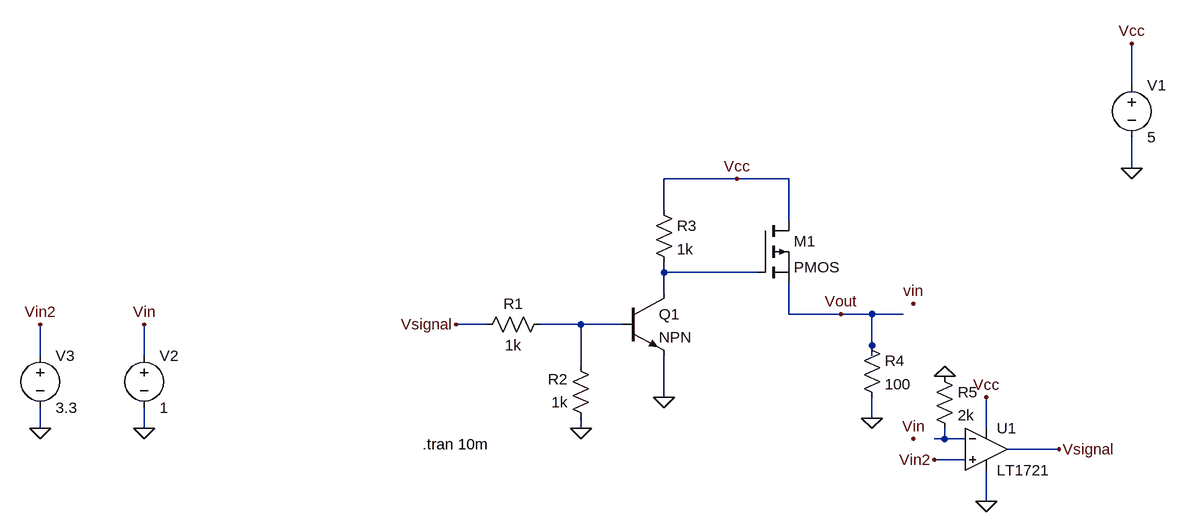
[diagram p0: schematic mosfet_as_relay.asc]
mosfet_as_relay.asc, the LTspice schematic file:
Version 4
SHEET 1 952 680
WIRE 896 -192 896 -256
WIRE 896 -64 896 -112
WIRE 288 -48 176 -48
WIRE 368 -48 288 -48
WIRE 176 0 176 -48
WIRE 368 16 368 -48
WIRE 176 96 176 80
WIRE 320 96 176 96
WIRE 176 128 176 96
WIRE 368 160 368 112
WIRE 448 160 368 160
WIRE 496 160 448 160
WIRE 544 160 496 160
WIRE -96 176 -144 176
WIRE 48 176 -16 176
WIRE 112 176 48 176
WIRE 496 208 496 160
WIRE -784 224 -784 176
WIRE -624 224 -624 176
WIRE 496 224 496 208
WIRE 48 240 48 176
WIRE 176 288 176 224
WIRE 496 320 496 288
WIRE -784 336 -784 304
WIRE -624 336 -624 304
WIRE 48 336 48 320
WIRE 672 336 672 288
WIRE 608 352 608 336
WIRE 608 352 592 352
WIRE 640 352 608 352
WIRE 784 368 704 368
WIRE 640 384 592 384
WIRE 672 448 672 400
FLAG 176 288 0
FLAG 448 160 Vout
FLAG 48 336 0
FLAG -144 176 Vsignal
FLAG 896 -64 0
FLAG 896 -256 Vcc
FLAG 288 -48 Vcc
FLAG -624 336 0
FLAG -624 176 Vin
FLAG -784 336 0
FLAG -784 176 Vin2
FLAG 672 448 0
FLAG 672 288 Vcc
FLAG 784 368 Vsignal
FLAG 592 384 Vin2
FLAG 560 352 Vin
FLAG 560 144 vin
FLAG 496 320 0
FLAG 608 256 0
SYMBOL npn 112 128 R0
SYMATTR InstName Q1
SYMBOL res 0 160 R90
WINDOW 0 0 56 VBottom 2
WINDOW 3 32 56 VTop 2
SYMATTR InstName R1
SYMATTR Value 1k
SYMBOL res 64 336 R180
WINDOW 0 36 76 Left 2
WINDOW 3 36 40 Left 2
SYMATTR InstName R2
SYMATTR Value 1k
SYMBOL res 160 -16 R0
SYMATTR InstName R3
SYMATTR Value 1k
SYMBOL pmos 320 16 R0
SYMATTR InstName M1
SYMBOL voltage 896 -208 R0
WINDOW 123 0 0 Left 0
WINDOW 39 0 0 Left 0
SYMATTR InstName V1
SYMATTR Value 5
SYMBOL voltage -624 208 R0
WINDOW 123 0 0 Left 0
WINDOW 39 0 0 Left 0
SYMATTR InstName V2
SYMATTR Value 1
SYMBOL Comparators\\LT1721 672 304 R0
SYMATTR InstName U1
SYMBOL voltage -784 208 R0
WINDOW 123 0 0 Left 0
WINDOW 39 0 0 Left 0
SYMATTR InstName V3
SYMATTR Value 3.3
SYMBOL res 480 192 R0
SYMATTR InstName R4
SYMATTR Value 100
SYMBOL res 592 240 R0
SYMATTR InstName R5
SYMATTR Value 2k
TEXT -196 360 Left 2 !.tran 10m

The netlist it stands for:
* mosfet_as_relay.asc
Q1 N001 N002 0 0 NPN
R1 N002 Vsignal 1k
R2 0 N002 1k
R3 Vcc N001 1k
M1 Vcc N001 Vout Vout PMOS
V1 Vcc 0 5
V2 Vin 0 1
XU1 Vin2 N003 Vcc 0 Vsignal LT1720  ; LT1721, pins In+ In- V+ V- OUT
V3 Vin2 0 3.3
R4 Vout 0 100
R5 0 N003 2k
.model NPN NPN
.model PNP PNP
.lib standard.bjt
.model NMOS NMOS
.model PMOS PMOS
.lib standard.mos
.tran 10m
.lib LTC.lib
.backanno
.end